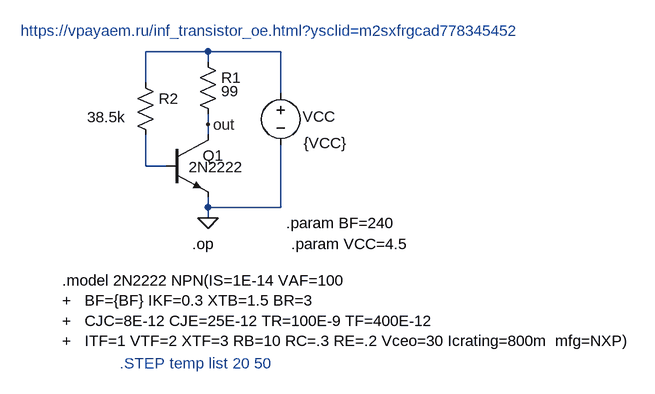
[diagram p0: schematic ampl_op.asc]
ampl_op.asc, the LTspice schematic file:
Version 4
SHEET 1 972 680
WIRE 240 -48 144 -48
WIRE 352 -48 240 -48
WIRE 240 -32 240 -48
WIRE 144 0 144 -48
WIRE 352 16 352 -48
WIRE 240 64 240 48
WIRE 240 80 240 64
WIRE 144 128 144 80
WIRE 176 128 144 128
WIRE 240 192 240 176
WIRE 352 192 352 96
WIRE 352 192 240 192
WIRE 240 208 240 192
FLAG 240 208 0
FLAG 240 64 out
SYMBOL npn 176 80 R0
WINDOW 3 34 50 Left 2
SYMATTR Value 2N2222
SYMATTR InstName Q1
SYMBOL res 224 -48 R0
WINDOW 3 36 61 Left 2
SYMATTR Value 99
SYMATTR InstName R1
SYMBOL res 128 -16 R0
WINDOW 3 -74 69 Left 2
SYMATTR Value 38.5k
SYMATTR InstName R2
SYMBOL voltage 352 0 R0
WINDOW 0 34 52 Left 2
WINDOW 3 35 93 Left 2
SYMATTR InstName VCC
SYMATTR Value {VCC}
TEXT 216 248 Left 2 !.op
TEXT -48 -80 Left 2 ;https://vpayaem.ru/inf_transistor_oe.html?ysclid=m2sxfrgcad778345452
TEXT 360 216 Left 2 !.param BF=240
TEXT 16 304 Left 2 !.model 2N2222 NPN(IS=1E-14 VAF=100\n+   BF={BF} IKF=0.3 XTB=1.5 BR=3\n+   CJC=8E-12 CJE=25E-12 TR=100E-9 TF=400E-12\n+   ITF=1 VTF=2 XTF=3 RB=10 RC=.3 RE=.2 Vceo=30 Icrating=800m  mfg=NXP)
TEXT 104 432 Left 2 ;.STEP temp list 20 50
TEXT 368 248 Left 2 !.param VCC=4.5

The netlist it stands for:
* ampl_op.asc
Q1 out N002 0 0 2N2222
R1 N001 out 99
R2 N001 N002 38.5k
VCC N001 0 {VCC}
.model NPN NPN
.model PNP PNP
.lib standard.bjt
.op
* https://vpayaem.ru/inf_transistor_oe.html?ysclid=m2sxfrgcad778345452
.param BF=240
.model 2N2222 NPN(IS=1E-14 VAF=100
+   BF={BF} IKF=0.3 XTB=1.5 BR=3
+   CJC=8E-12 CJE=25E-12 TR=100E-9 TF=400E-12
+   ITF=1 VTF=2 XTF=3 RB=10 RC=.3 RE=.2 Vceo=30 Icrating=800m  mfg=NXP)
* .STEP temp list 20 50
.param VCC=4.5
.backanno
.end